# EAGLE schematic heater (EAGLE 9.2.0)
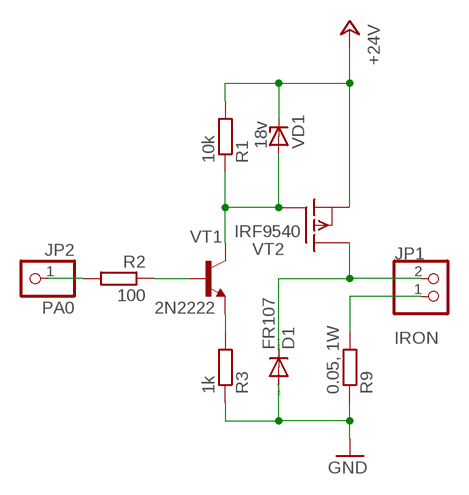
[diagram p0: schematic, sheet 1]

## Parts
D1  FR107  1N4004  [DO41-10]
JP1  IRON  PINHD-1X2  [1X02]
JP2  PA0  PINHD-1X1  [1X01]
R1  10k  R-EU_0207/10  [0207/10]
R2  100  R-EU_0207/10  [0207/10]
R3  1k  R-EU_0207/10  [0207/10]
R9  0.05, 1W  R-EU_0207/10  [0207/10]
VD1  18v  ZENER-DIODEC1702-15  [C1702-15]
VT1  2N2222  [TO18]
VT2  IRF9540  IRF9530  [TO220]

## Nets
+24V: R1.2 VD1.C VT2.3(S)
GND: D1.A R3.1 R9.1
N$1: JP1.1 R9.2
N$2: D1.C JP1.2 VT2.2(D)
N$4: R1.1 VD1.A VT1.3(C) VT2.1(G)
N$7: R3.2 VT1.1(E)
N$8: R2.1 VT1.2(B)
N$9: JP2.1 R2.2

## Library data of the parts
D1 = diode:1N4004: DIODE general purpose rectifier, 1 A
JP1 = pinhead:PINHD-1X2: PIN HEADER
JP2 = pinhead:PINHD-1X1: PIN HEADER
R1-R3 R9 = rcl:R-EU_: RESISTOR, European symbol; SPICEPREFIX: R
VD1 = diode:ZENER-DIODE: Z-Diode
VT1 = transistor:2N2222: NPN TRANSISTOR
VT2 = transistor-fet:IRF9530: P-Channel Enhancement MOSFET (HEXFET); -100V; -12A; 0,3Ohm